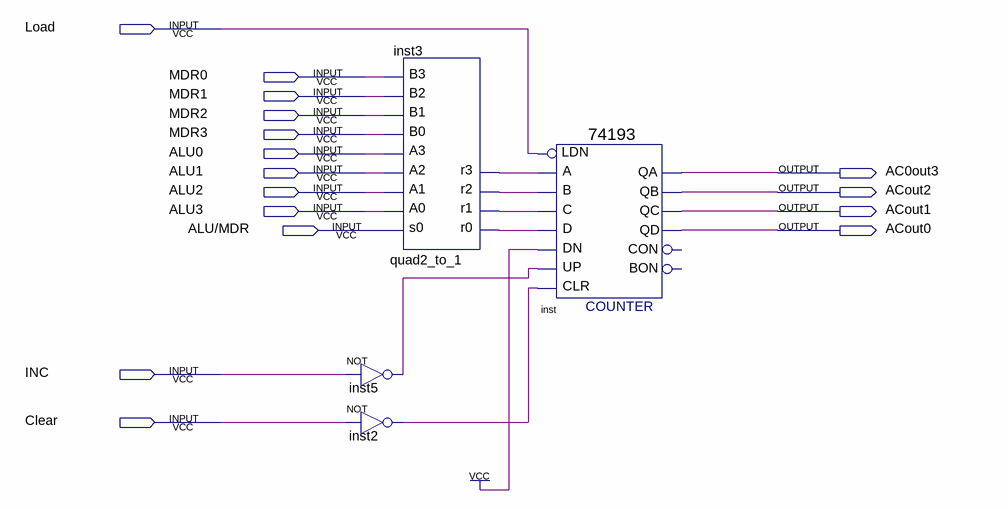
[diagram p0: schematic sheet]
// Quartus schematic FourBitUpCounter.bdf as structural Verilog: 4 symbols, 16 pins
module FourBitUpCounter (
  input  Load,
  input  MDR0,
  input  MDR1,
  input  MDR2,
  input  MDR3,
  input  ALU0,
  input  ALU1,
  input  ALU2,
  input  ALU3,
  input  \ALU/MDR ,
  input  INC,
  input  Clear,
  output AC0out3,
  output ACout2,
  output ACout1,
  output ACout0
);

  wire inst2_out, inst3_r0, inst3_r1, inst3_r2, inst3_r3, inst5_out;

  not inst5 (inst5_out, INC);
  not inst2 (inst2_out, Clear);
  quad2_to_1 inst3 (
    .s0(\ALU/MDR ), .A0(ALU3), .A1(ALU2), .A2(ALU1), .A3(ALU0), .B0(MDR3), .B1(MDR2), .B2(MDR1), .B3(MDR0),
    .r0(inst3_r0), .r1(inst3_r1), .r2(inst3_r2), .r3(inst3_r3));
  \74193  inst (
    .D(inst3_r0), .C(inst3_r1), .B(inst3_r2), .A(inst3_r3), .CLR(inst2_out), .UP(inst5_out), .DN(1'b1),
    .LDN(Load), .QB(ACout2), .QA(AC0out3), .QD(ACout0), .QC(ACout1));  // open: CON, BON
endmodule
